# EAGLE design lightboard-215 (EAGLE 9.6.2)
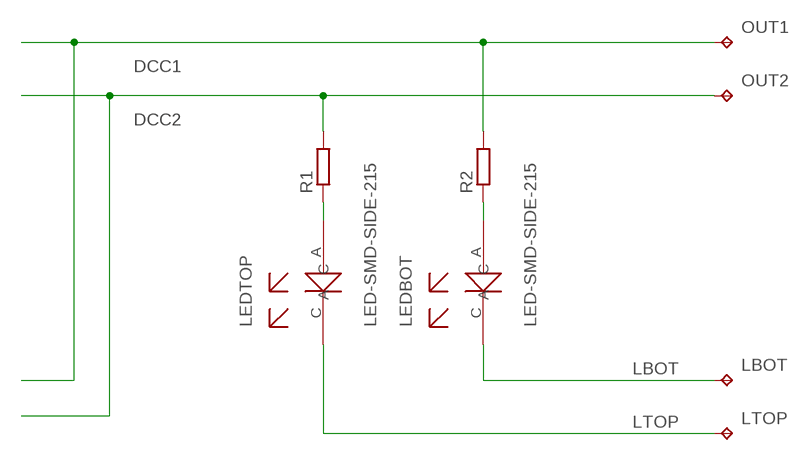
[diagram p0: schematic, sheet 1]

## Parts
LBOT  TPB1,27  [B1,27]
LEDBOT  LED-SMD-SIDE-215  [LED-SMD-SIDE-215]
LEDTOP  LED-SMD-SIDE-215  [LED-SMD-SIDE-215]
LTOP  TPB1,27  [B1,27]
OUT1  TPB1,27  [B1,27]
OUT2  TPB1,27  [B1,27]
R1  R-EU_R0805  [R0805]
R2  R-EU_R0805  [R0805]

## Nets
DCC1: OUT1.TP R2.2
DCC2: OUT2.TP R1.2
LBOT: LBOT.TP LEDBOT.C
LTOP: LEDTOP.C LTOP.TP
N$1: LEDTOP.A R1.1
N$2: LEDBOT.A R2.1

## Library data of the parts
LBOT LTOP OUT1 OUT2 = testpad:TP: Test pad
LEDBOT LEDTOP = 78m05:LED-SMD-SIDE-215
R1 R2 = resistor:R-EU_: RESISTOR, European symbol

## Board
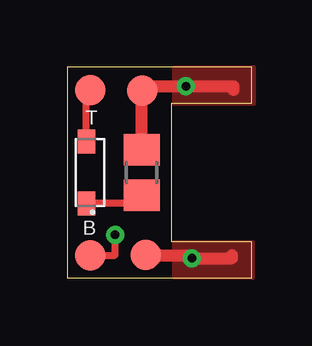
[diagram p1: board, top side]
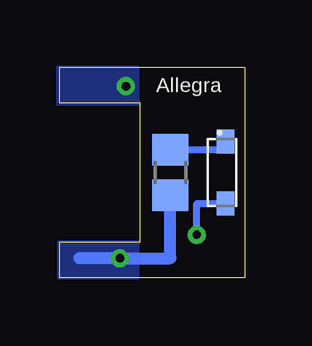
[diagram p2: board, bottom side, seen from below]

Size 7.7 x 8.8 mm. Coordinates in mm from the lower left corner, seen from the top.
Outline: 0,0 7.7,0 7.7,1.5 4.35,1.5 4.35,7.3 7.7,7.3 7.7,8.8 0,8.8 0,0
Copper layers (1*16): Top 0.035mm / dielectric 1.5mm / Bottom 0.035mm
Design rules "aisler_2_layer_simple *": minimum track width 0.1mm, minimum drill 0.3mm, track to track 0.2mm, track to pad 0.2mm, pad to pad 0.2mm, via to via 0.2mm, smd to smd 0.1mm, copper to edge 0mil, drill to drill 0.25mm, minimum pad ring 0.2mm, minimum via ring 0.2mm, stop-mask expansion 0mil, vias tented up to drill 0mil, thermal gap 10mil

### Footprints (pad centres in the part's own frame; a part is rotated, then mirrored left to right if it is on the bottom)
B1,27 = smd 1.27 x 1.27: TP 0,0
LED-SMD-SIDE-215 = smd 1 x 0.72: A -1.3,0; C 1.3,0
R0805 = smd 1.3 x 1.5: 1 -0.95,0; 2 0.95,0

### Placement (x,y rotation side)
LBOT  0.97,0.95 0 top
LEDBOT  0.8,4.4 270 bottom
LEDTOP  0.8,4.4 90 top
LTOP  0.97,7.83 0 top
OUT1  3.27,0.97 0 top
OUT2  3.12,7.82 0 top
R1  3.1,4.4 90 top
R2  3.1,4.4 270 bottom

### Tracks (layer width: path | path; a pad name or v marks a point on that pad's centre or on a via)
DCC1  (via drill 0.35)
  Top 0.5: OUT1.TP 3.8,0.97 3.8,0.95 5.2,0.95 v5.2,0.82 6.87,0.82 6.87,0.95
  Bottom 0.5: 6.88,0.82 v5.2,0.82 3.1,0.82 R2.2
  pour Top: 4.45,1.5 7.75,1.5 7.75,0 4.45,0
  pour Bottom: 4.45,1.5 7.75,1.5 7.75,0 4.45,0
DCC2  (via drill 0.35)
  Top 0.5: 6.92,7.85 6.92,8 v4.95,8 3.12,8 OUT2.TP 3.1,7.82 R1.2
  pour Top: 4.45,8.8 7.8,8.8 7.8,7.25 4.45,7.25
  pour Bottom: 4.45,8.8 7.8,8.8 7.8,7.25 4.45,7.25
LBOT  (via drill 0.35)
  Top 0.3: LBOT.TP 2,0.95 v2,1.8
  Bottom 0.3: v2,1.8 2,3.1 LEDBOT.C
LTOP
  Top 0.3: LEDTOP.C 0.8,7.83 LTOP.TP
N$1
  Top 0.3: R1.1 3.1,3.1 LEDTOP.A
N$2
  Bottom 0.3: R2.1 0.8,5.35 LEDBOT.A

### Text on the board
tNames: T | B
bNames: Allegra